# Altium schematic sheet PAGE1.SCHDOC: 916 MHZ Super Hetrodyne Receiver
size B; DocumentNumber: Page Create Date; Revision: 3; SheetNumber: 1; SheetTotal: 3
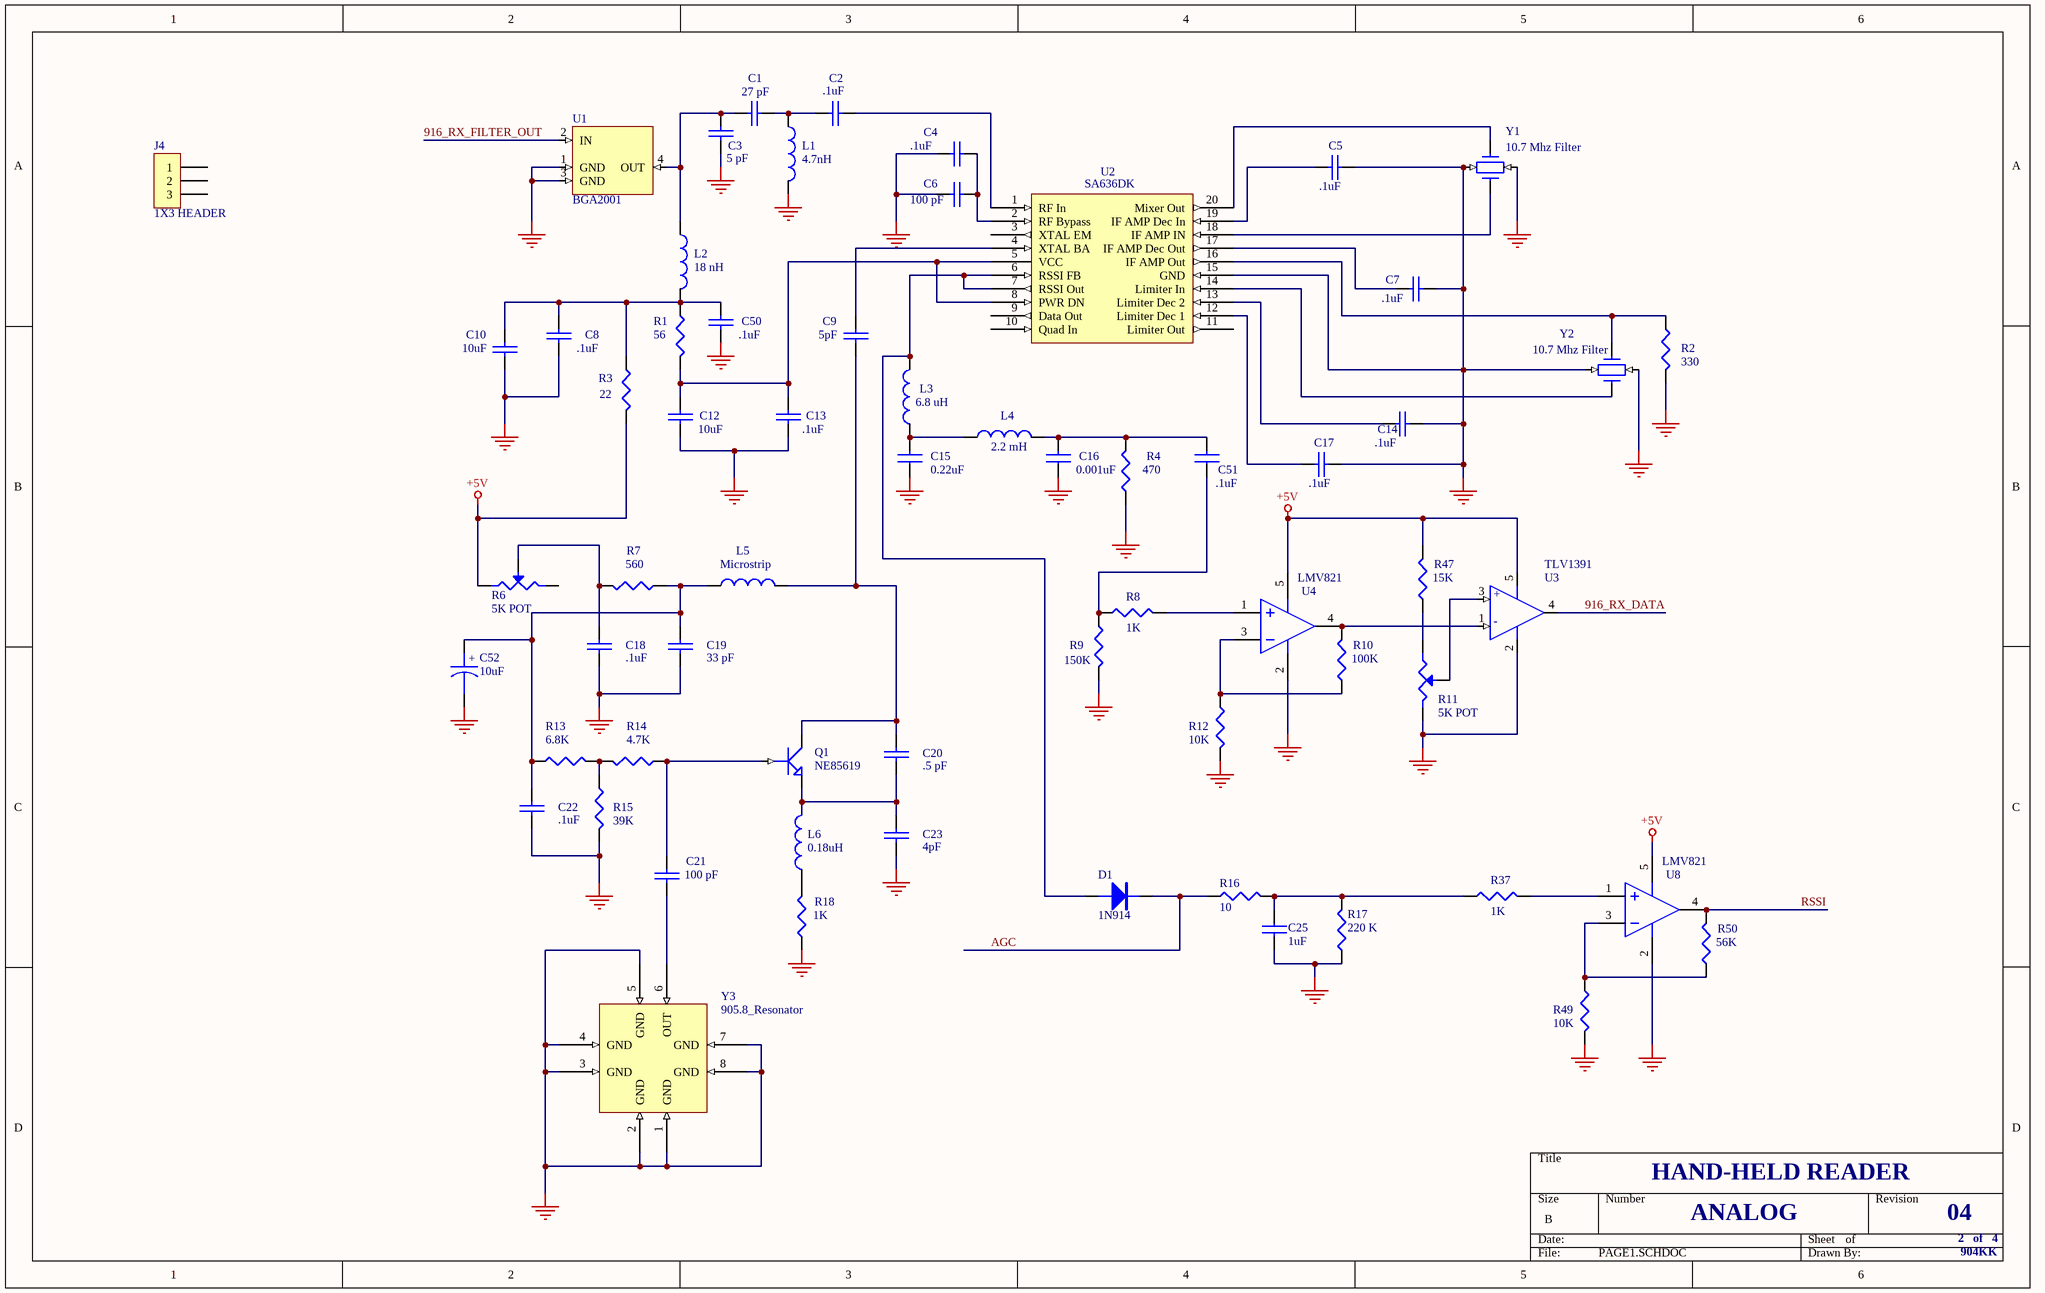
[diagram p0: PAGE1.SCHDOC]

## Parts
C1  27 pF  [0603]
C2  .1uF  [0603]
C3  5 pF  [0603]
C4  .1uF  [0603]
C5  .1uF  [0603]
C6  100 pF  [0603]
C7  .1uF  [0603]
C8  .1uF  [0603]
C9  5pF  [0603]
C10  10uF  [CAP A CASE]
C12  10uF  [CAP A CASE]
C13  .1uF  [0603]
C14  .1uF  [0603]
C15  0.22uF  [0603]
C16  0.001uF  [0603]
C17  .1uF  [0603]
C18  .1uF  [0603]
C19  33 pF  [0603]
C20  .5 pF  [0603]
C21  100 pF  [0603]
C22  .1uF  [0603]
C23  4pF  [0603]
C25  1uF  [CAP A CASE]
C50  .1uF  [0603]
C51  .1uF  [0603]
C52  10uF  [CAP A CASE]
D1  1N914  [SOT23 DIODE]
J4  1X3 HEADER  [1X3 HEADER]
L1  4.7nH  [0603]
L2  18 nH  [0603]
L3  6.8 uH  [0805]
L4  2.2 mH  [COIL 6.8UH]
L5  Microstrip  [MICROSTRIP]
L6  0.18uH  [0603]
Q1  NE85619  [3 PIN ULTRA SUPER MINI MOLD]
R1  56  [0603]
R2  330  [0603]
R3  22  [0603]
R4  470  [0603]
R6  5K POT  [POT PANA EVN5]
R7  560  [0603]
R8  1K  [0603]
R9  150K  [0603]
R10  100K  [0603]
R11  5K POT  [POT PANA EVN5]
R12  10K  [0603]
R13  6.8K  [0603]
R14  4.7K  [0603]
R15  39K  [0603]
R16  10  [0603]
R17  220 K  [0603]
R18  1K  [0603]
R37  1K  [0603]
R47  15K  [0603]
R49  10K  [0603]
R50  56K  [0603]
U1  BGA2001  [SOT343]
U2  SA636DK  [SSOP20]
U3  TLV1391  [SOT25]
U4  LMV821  [SOT25]
U8  LMV821  [SOT25]
Y1  10.7 Mhz Filter  [FILTER]
Y2  10.7 Mhz Filter  [FILTER]
Y3  905.8_Resonator  [RESONATOR]

## Nets
+5V: R3.2 R6.1 R47.2 U3.5(VDD) U4.5 U8.5
GND_SIGNAL: C3.2 C4.1 C5.2 C6.1 C7.2 C8.2 C10.2 C12.2 C13.2 C14.2 C15.1 C16.1 C17.2 C18.2 C19.2 C22.2 C23.2 C25.2 C50.2 C52.2 L1.2 R2.2 R4.1 R9.2 R11.3 R12.2 R15.2 R17.2 R18.1 R49.2 U1.1(GND) U1.3(GND) U2.15(GND) U3.2(VSS) U4.2 U8.2 Y1.2 Y2.2 Y3.1(GND) Y3.2(GND) Y3.3(GND) Y3.4(GND) Y3.5(GND) Y3.7(GND) Y3.8(GND)
916_RX_DATA: U3.4(OUT)
916_RX_FILTER_OUT: U1.2(IN)
AGC: D1.K R16.2
RSSI: R50.2 U8.4
NetC1_1: C1.1 C3.1 L2.1 U1.4(OUT)
NetC1_2: C1.2 C2.1 L1.1
NetC2_2: C2.2 U2.1(RF_In)
NetC4_2: C4.2 C6.2 U2.2(RF_Bypass)
NetC5_1: C5.1 U2.19(IF_AMP_Dec_In)
NetC7_1: C7.1 U2.17(IF_AMP_Dec_Out)
NetC8_1: C8.1 C10.1 C50.1 L2.2 R1.1 R3.1
NetC9_1: C9.1 C20.1 L5.2 Q1.C
NetC9_2: C9.2 U2.4(XTAL_BA)
NetC12_1: C12.1 C13.1 R1.2 U2.5(VCC) U2.8(PWR_DN)
NetC14_1: C14.1 U2.13(Limiter_Dec_2)
NetC15_2: C15.2 L3.1 L4.1
NetC16_2: C16.2 C51.2 L4.2 R4.2
NetC17_1: C17.1 U2.12(Limiter_Dec_1)
NetC18_1: C18.1 R6.2 R7.2
NetC19_1: C19.1 C22.1 C52.1 L5.1 R7.1 R13.1
NetC20_2: C20.2 C23.1 L6.2 Q1.E
NetC21_1: C21.1 Q1.B R14.1
NetC21_2: C21.2 Y3.6(OUT)
NetC25_1: C25.1 R16.1 R17.1 R37.1
NetC51_1: C51.1 R8.1 R9.1
NetD1_A: D1.A L3.2 U2.6(RSSI_FB) U2.7(RSSI_Out)
NetL6_1: L6.1 R18.2
NetR2_1: R2.1 U2.16(IF_AMP_Out) Y2.1
NetR8_2: R8.2 U4.1
NetR10_1: R10.1 R12.1 U4.3
NetR10_2: R10.2 U3.1(-) U4.4
NetR11_1: R11.1 R47.1
NetR11_2: R11.2 U3.3(+)
NetR13_2: R13.2 R14.2 R15.1
NetR37_2: R37.2 U8.1
NetR49_1: R49.1 R50.1 U8.3
NetU2_14: U2.14(Limiter_In) Y2.3
NetU2_18: U2.18(IF_AMP_IN) Y1.3
NetU2_20: U2.20(Mixer_Out) Y1.1

Not connected (* = marked no-connect by the designer): J4 1 2 3; R6 3; U2 3(XTAL_EM) 9(Data_Out) 10(Quad_In) 11(Limiter_Out)

## Notes on the sheet
- HAND-HELD READER
- ANALOG
- 04
- 2   of   4
- 904KK
- (in symbol CAPACITOR POL) +

## Library data of the parts
C1-C10 C12-C14 C17-C23 C50 = CAP: Capacitor
C15 C16 C25 C51 = CAP_NP: Text Field1: 20; Text Field2: 10
C52 = CAPACITOR POL: Capacitor
D1 = DIODE
J4 = CON3: Connector
L1-L6 = INDUCTOR: Text Field1: 20; Text Field2: 40
Q1 = NPN1: NPN Transistor
R1-R4 R8-R10 R12 R16 R17 R37 R47 R49 R50 = R: Text Field1: 20; Text Field2: 30
R6 R11 = POT1: Potentiometer
R7 R13-R15 R18 = RESISTOR: Text Field1: 20; Text Field2: 30
U2 = SA636DK: Text Field1: 120; Text Field2: 110
U3 = TLV1391: Text Field1: 40; Text Field2: 40
U4 U8 = OPAMP1
Y1 Y2 = FILTER
Y3 = RESONATOR